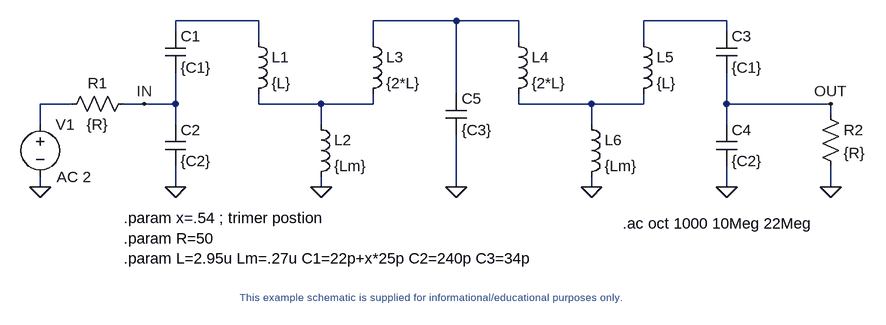
[diagram p0: schematic Cohn.asc]
Cohn.asc, the LTspice schematic file:
Version 4
SHEET 1 2316 1728
WIRE 1360 1168 1232 1168
WIRE 1664 1168 1536 1168
WIRE 1760 1168 1664 1168
WIRE 2080 1168 1952 1168
WIRE 1232 1184 1232 1168
WIRE 2080 1184 2080 1168
WIRE 1360 1200 1360 1168
WIRE 1536 1200 1536 1168
WIRE 1760 1200 1760 1168
WIRE 1952 1200 1952 1168
WIRE 1664 1280 1664 1168
WIRE 1072 1296 1024 1296
WIRE 1184 1296 1152 1296
WIRE 1232 1296 1232 1248
WIRE 1232 1296 1184 1296
WIRE 1360 1296 1360 1280
WIRE 1456 1296 1360 1296
WIRE 1536 1296 1536 1280
WIRE 1536 1296 1456 1296
WIRE 1760 1296 1760 1280
WIRE 1872 1296 1760 1296
WIRE 1952 1296 1952 1280
WIRE 1952 1296 1872 1296
WIRE 2080 1296 2080 1248
WIRE 2240 1296 2080 1296
WIRE 2240 1312 2240 1296
WIRE 1024 1328 1024 1296
WIRE 1232 1328 1232 1296
WIRE 1456 1328 1456 1296
WIRE 1872 1328 1872 1296
WIRE 2080 1328 2080 1296
WIRE 1024 1424 1024 1408
WIRE 1232 1424 1232 1392
WIRE 1456 1424 1456 1408
WIRE 1664 1424 1664 1344
WIRE 1872 1424 1872 1408
WIRE 2080 1424 2080 1392
WIRE 2240 1424 2240 1392
FLAG 2080 1424 0
FLAG 1872 1424 0
FLAG 1456 1424 0
FLAG 1232 1424 0
FLAG 1664 1424 0
FLAG 1024 1424 0
FLAG 2240 1424 0
FLAG 2240 1296 OUT
FLAG 1184 1296 IN
SYMBOL ind 1344 1184 R0
SYMATTR InstName L1
SYMATTR Value {L}
SYMBOL ind 1440 1312 R0
SYMATTR InstName L2
SYMATTR Value {Lm}
SYMBOL ind 1520 1184 R0
SYMATTR InstName L3
SYMATTR Value {2*L}
SYMBOL ind 1744 1184 R0
SYMATTR InstName L4
SYMATTR Value {2*L}
SYMBOL ind 1936 1184 R0
SYMATTR InstName L5
SYMATTR Value {L}
SYMBOL ind 1856 1312 R0
SYMATTR InstName L6
SYMATTR Value {Lm}
SYMBOL cap 1216 1184 R0
SYMATTR InstName C1
SYMATTR Value {C1}
SYMBOL cap 1216 1328 R0
SYMATTR InstName C2
SYMATTR Value {C2}
SYMBOL cap 2064 1184 R0
SYMATTR InstName C3
SYMATTR Value {C1}
SYMBOL cap 2064 1328 R0
SYMATTR InstName C4
SYMATTR Value {C2}
SYMBOL cap 1648 1280 R0
SYMATTR InstName C5
SYMATTR Value {C3}
SYMBOL VOLTAGE 1024 1312 R0
WINDOW 3 25 97 Left 2
SYMATTR Value AC 2
SYMATTR InstName V1
SYMBOL RES 1168 1280 R90
WINDOW 0 0 56 VBottom 2
WINDOW 3 32 56 VTop 2
SYMATTR InstName R1
SYMATTR Value {R}
SYMBOL res 2224 1296 R0
SYMATTR InstName R2
SYMATTR Value {R}
TEXT 1920 1480 Left 2 !.ac oct 1000 10Meg 22Meg
TEXT 1152 1472 Left 2 !.param x=.54 ; trimer postion\n.param R=50\n.param L=2.95u Lm=.27u C1=22p+x*25p C2=240p C3=34p
TEXT 1616 1584 Top 1 ;This example schematic is supplied for informational/educational purposes only.

The netlist it stands for:
* Cohn.asc
L1 N001 N005 {L}
L2 N005 0 {Lm}
L3 N002 N005 {2*L}
L4 N002 N006 {2*L}
L5 N003 N006 {L}
L6 N006 0 {Lm}
C1 N001 IN {C1}
C2 IN 0 {C2}
C3 N003 OUT {C1}
C4 OUT 0 {C2}
C5 N002 0 {C3}
V1 N004 0 AC 2
R1 IN N004 {R}
R2 OUT 0 {R}
.ac oct 1000 10Meg 22Meg
.param x=.54 ; trimer postion
.param R=50
.param L=2.95u Lm=.27u C1=22p+x*25p C2=240p C3=34p
* This example schematic is supplied for informational/educational purposes only.
.backanno
.end